# Altium schematic sheet PMU.SchDoc: Power Management
size A3; Organization: CU Boulder; DocumentNumber: 007; Revision: 1.1; SheetNumber: 7; SheetTotal: 8
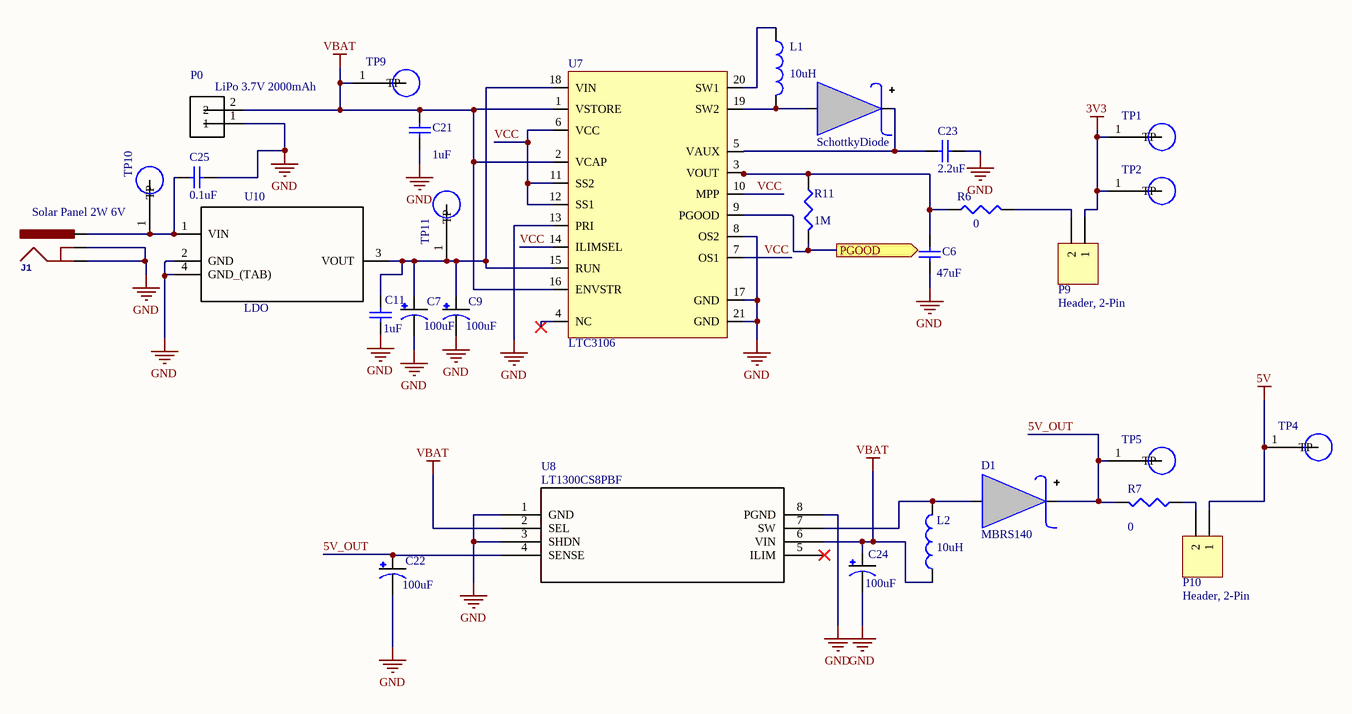
[diagram p0: PMU.SchDoc]

## Parts
C6  47uF  [1608[0603]]
C7  100uF  [CAPAE1050X1050N]
C9  100uF  [CAPAE1050X1050N]
C11  1uF  [1608[0603]]
C21  1uF  [1608[0603]]
C22  100uF  [CAPAE1050X1050N]
C23  2.2uF  [1608[0603]]
C24  100uF  [CAPAE1050X1050N]
C25  0.1uF  [1608[0603]]
D1  MBRS140  [DO-214AC]
J1  Power Jack  [POWER_JACK_SMD]  (value not drawn)
L1  10uH  [INDM7366X500]
L2  10uH  [INDM7366X500]
P0  Battery Connector  [JST_B2B-PH-SM4-TB]  (value not drawn)
P9  Header, 2-Pin  [HDR1X2]
P10  Header, 2-Pin  [HDR1X2]
R6  0  [J1-0603]
R7  0  [J1-0603]
R11  1M  [J1-0603]
SchottkyDiode  SOD2513X120N  [SOD2513X120N]  (value not drawn)
TP1  Test Points  [TP380X203]  (value not drawn)
TP2  Test Points  [TP380X203]  (value not drawn)
TP4  Test Points  [TP380X203]  (value not drawn)
TP5  Test Points  [TP380X203]  (value not drawn)
TP9  Test Points  [TP380X203]  (value not drawn)
TP10  Test Points  [TP380X203]  (value not drawn)
TP11  Test Points  [TP380X203]  (value not drawn)
U7  LTC3106  [LTC3106]
U8  LT1300CS8PBF  [SOIC-8_S]
U10  LDO  [SOT230P700X180-4N]

## Ports
PGOOD (out)

## Nets
3V3: P9.1 TP1.1(TP) TP2.1(TP)
5V: P10.1 TP4.1(TP)
GND: C6.1 C7.2(NEG) C9.2(NEG) C11.1 C21.1 C22.2(NEG) C23.1 C24.2(NEG) C25.1 J1.GND(GNDBREAK) J1.P$4(GND) P0.1 U7.8(OS2) U7.13(PRI) U7.17(GND) U7.21(GND) U8.1(GND) U8.3(SHDN) U8.8(PGND) U10.2(GND) U10.4(GND_(TAB))
VBAT: C21.2 C24.1(POS) L2.1 P0.2 TP9.1(TP) U7.1(VSTORE) U7.2(VCAP) U7.16(ENVSTR) U8.2(SEL) U8.6(VIN)
5V_OUT: C22.1(POS) D1.2 R7.2 TP5.1(TP) U8.4(SENSE)
PGOOD: R11.2 U7.9(PGOOD) ; port PGOOD
VCC: U7.6(VCC) U7.7(OS1) U7.10(MPP) U7.11(SS2) U7.12(SS1) U7.14(ILIMSEL)
NetC6_2: C6.2 R6.1 R11.1 U7.3(VOUT)
NetC7_1: C7.1(POS) C9.1(POS) C11.2 TP11.1(TP) U7.15(RUN) U7.18(VIN) U10.3(VOUT)
NetC23_2: C23.2 SchottkyDiode.2 U7.5(VAUX)
NetC25_2: C25.2 J1.VIN0(PWR) TP10.1(TP) U10.1(VIN)
NetD1_1: D1.1 L2.2 U8.7(SW)
NetL1_1: L1.1 U7.20(SW1)
NetL1_2: L1.2 SchottkyDiode.1 U7.19(SW2)
NetP9_2: P9.2 R6.2
NetP10_2: P10.2 R7.1

Not connected (* = marked no-connect by the designer): U7 4(NC)*; U8 5(ILIM)*

## Notes on the sheet
- (near P0) LiPo 3.7V 2000mAh
- Solar Panel 2W 6V
- Title
- Size:
- Date:
- A3
- Number:
- Time:
- Revision:
- Sheet
- of
- File:

## Library data of the parts
C6 C11 C21 C23 C25 = Cap Semi: Capacitor (Semiconductor SIM Model); Published: 8-Jun-2000; LatestRevisionDate: 29-May-2009; LatestRevisionNote: IPC-7351 Footprint Added.; PackageReference: C1206; Publisher: Altium Limited; PackageDescription: Chip Capacitor; Supplier 1: Digi-Key
  C6: Value: 47uF; Supplier Part Number 1: 478-11180-2-ND
  C11 C21: Value: 1uF; Supplier Part Number 1: 1276-1946-6-ND
  C23: Value: 2.2uF; Supplier Part Number 1: 587-2983-6-ND
  C25: Value: 0.1uF; Supplier Part Number 1: 311-1088-6-ND
C7 C9 C22 C24 = MAL214699103E3: 146 CTI Series 50 V 100 uF 10 x 10 x 10 mm SMT CAN Electrolytic Capacitor; MF: Vishay; Price: 1.31 USD; Package: Radial Vishay; Availability: Good; MP: MAL214699103E3; Value: 100uF; Supplier 1: Digi-Key; Supplier Part Number 1: 4437PHCT-ND
J1 = POWER_JACKSMD: PROD_ID: CONN-08106; SF_ID: PRT-12748
L1 L2 = Inductor: Code_IEC: 1005; Published: 8-Jun-2000; LatestRevisionDate: 29-May-2009; LatestRevisionNote: IPC-7351 Footprint Added.; PackageReference: 0402-A; Publisher: Altium Limited; PackageDescription: Chip Inductor; Code_JEITA: 0402; Value: 10uH; Supplier 1: Digi-Key; Supplier Part Number 1: 732-1025-1-ND
P0 = B2B-PH-SM4-TB: MF: JST; Package: None; MP: B2B-PH-SM4-TB; Availability: Unavailable; Price: 0.23 USD; Value: *
P9 P10 = Header 2: LatestRevisionDate: 17-Jul-2002; LatestRevisionNote: Re-released for DXP Platform.; Publisher: Altium Limited; Supplier 1: Digi-Key; Supplier Part Number 1: 732-5327-ND
R6 R7 R11 = Res3: Resistor; Published: 8-Jun-2000; LatestRevisionDate: 29-May-2009; LatestRevisionNote: IPC-7351 Footprint Added.; PackageReference: J1-0603; Publisher: Altium Limited; PackageDescription: Chip Resistor; Supplier 1: Digi-Key
  R6 R7: Value: 0; Supplier Part Number 1: 732-4484-6-ND
  R11: Value: 1M; Supplier Part Number 1: 311-1.00MHRDKR-ND
TP1 TP2 TP4 TP5 TP9-TP11 = 5019: Phosphor Bronze Contact Miniature Silver Plated Surface Mount Test Points; MF: Keystone; Digi-Key_Part_Number: 36-5019CT-ND; Digi-Key_Purchase_URL: https://www.digikey.com/product-detail/en/keystone-electronics/5019/36-5019CT-ND/3907344?WT.z_cid=ref_snapeda; MP: 5019; Package: None; Value: *; Supplier 1: Digi-Key
  TP1 TP2 TP10: Supplier Part Number 1: 36-5019DKR-ND
  TP4 TP5 TP9 TP11: Supplier Part Number 1: 36-5019CT-ND
U8 = LT1300CS8PBF: PMIC - DC/DC voltage regulator Linear Technology LT1300CS8%23PBF Boost%2C Converter/amplifier SOIC 8; MP: LT1300CS8#PBF; Availability: Warning; Package: SO-8 Linear Technology; MF: Linear Technology; Price: 4.13 USD; Value: *
U10 = LM2937IMPX-5.0/NOPB: LDO Regulator Pos 5V 0.5A Automotive 4-Pin(3+Tab) SOT-223 T/R; MF: Texas Instruments; Package: SOT-223 Texas Instruments; Availability: Good; MP: LM2937IMPX-5.0/NOPB; Price: 1.07 USD; Value: *; Supplier 1: Digi-Key; Supplier Part Number 1: LT1300CS8#PBF-ND
D1 = MBRS140: Supplier 1: Digi-Key; Supplier Part Number 1: MBRS140T3GOSDKR-ND
SchottkyDiode = SOD2513X120N: Supplier 1: Digi-Key; Supplier Part Number 1: ZLLS400TADKR-ND
U7 = LTC3106: Supplier 1: Digi-Key; Supplier Part Number 1: LTC3106EUDC#PBF-ND